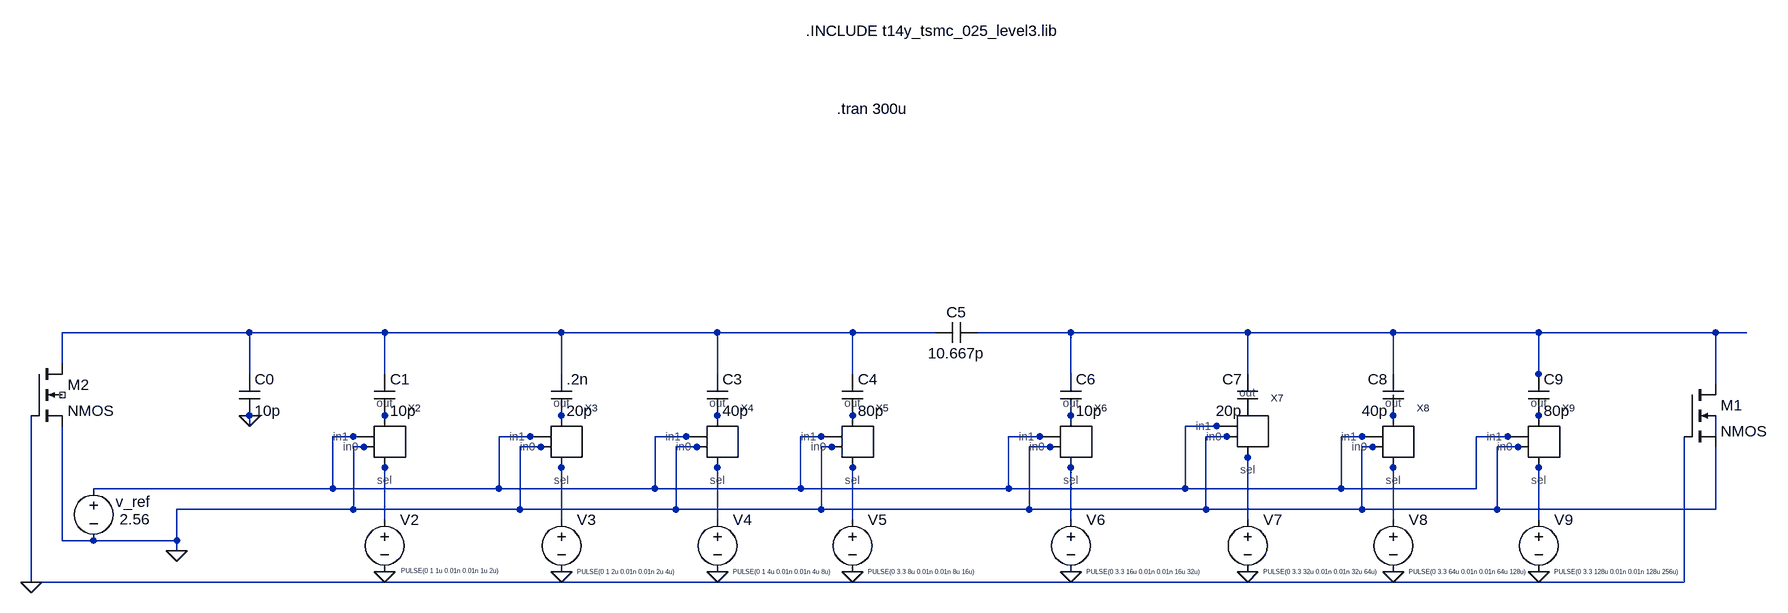
[diagram p0: schematic dac.asc]
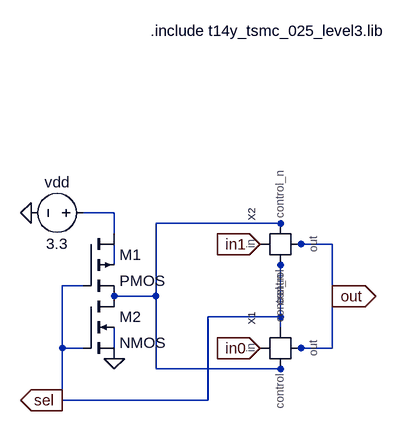
[diagram p1: sub-circuit t_mux.asc]
dac.asc, the LTspice schematic file:
Version 4
SHEET 1 1884 680
WIRE -576 16 -864 16
WIRE -368 16 -576 16
WIRE -96 16 -368 16
WIRE 144 16 -96 16
WIRE 352 16 144 16
WIRE 480 16 352 16
WIRE 688 16 544 16
WIRE 960 16 688 16
WIRE 1184 16 960 16
WIRE 1408 16 1184 16
WIRE 1680 16 1408 16
WIRE 1728 16 1680 16
WIRE -864 64 -864 16
WIRE -576 80 -576 16
WIRE -368 80 -368 16
WIRE -96 80 -96 16
WIRE 144 80 144 16
WIRE 352 80 352 16
WIRE 688 80 688 16
WIRE 960 80 960 16
WIRE 1184 80 1184 16
WIRE 1408 80 1408 16
WIRE 1408 96 1408 80
WIRE 1680 96 1680 16
WIRE -576 144 -576 128
WIRE -368 144 -368 128
WIRE -96 144 -96 128
WIRE 144 144 144 128
WIRE 352 144 352 128
WIRE 688 144 688 128
WIRE 960 144 960 128
WIRE 1184 144 1184 112
WIRE 1408 144 1408 128
WIRE -576 160 -576 144
WIRE -368 160 -368 144
WIRE -96 160 -96 144
WIRE 144 160 144 144
WIRE 352 160 352 144
WIRE 688 160 688 144
WIRE 912 160 864 160
WIRE 944 160 912 160
WIRE 1184 160 1184 144
WIRE 1408 160 1408 144
WIRE -416 176 -448 176
WIRE -384 176 -416 176
WIRE -144 176 -192 176
WIRE -112 176 -144 176
WIRE 96 176 48 176
WIRE 128 176 96 176
WIRE 304 176 272 176
WIRE 336 176 304 176
WIRE 640 176 592 176
WIRE 672 176 640 176
WIRE 928 176 896 176
WIRE 944 176 928 176
WIRE 1136 176 1104 176
WIRE 1168 176 1136 176
WIRE 1360 176 1312 176
WIRE 1376 176 1360 176
WIRE 1680 176 1680 144
WIRE -400 192 -416 192
WIRE -384 192 -400 192
WIRE -128 192 -160 192
WIRE -112 192 -128 192
WIRE 112 192 80 192
WIRE 128 192 112 192
WIRE 320 192 304 192
WIRE 336 192 320 192
WIRE 656 192 624 192
WIRE 672 192 656 192
WIRE 1152 192 1136 192
WIRE 1168 192 1152 192
WIRE 1376 192 1344 192
WIRE 1392 192 1376 192
WIRE 960 208 960 192
WIRE -368 224 -368 208
WIRE -96 224 -96 208
WIRE 144 224 144 208
WIRE 352 224 352 208
WIRE 688 224 688 208
WIRE 1184 224 1184 208
WIRE 1408 224 1408 208
WIRE -448 256 -448 176
WIRE -448 256 -816 256
WIRE -192 256 -192 176
WIRE -192 256 -448 256
WIRE 48 256 48 176
WIRE 48 256 -192 256
WIRE 272 256 272 176
WIRE 272 256 48 256
WIRE 592 256 592 176
WIRE 592 256 272 256
WIRE 864 256 864 160
WIRE 864 256 592 256
WIRE 1104 256 1104 176
WIRE 1104 256 864 256
WIRE 1312 256 1312 176
WIRE 1312 256 1104 256
WIRE -416 288 -416 192
WIRE -416 288 -688 288
WIRE -160 288 -160 192
WIRE -160 288 -416 288
WIRE 80 288 80 192
WIRE 80 288 -160 288
WIRE 304 288 304 192
WIRE 304 288 80 288
WIRE 624 288 624 192
WIRE 624 288 304 288
WIRE 896 288 896 176
WIRE 896 288 624 288
WIRE 1136 288 1136 192
WIRE 1136 288 896 288
WIRE 1344 288 1344 192
WIRE 1344 288 1136 288
WIRE 1680 288 1680 192
WIRE 1680 288 1344 288
WIRE -368 304 -368 224
WIRE -96 304 -96 224
WIRE 144 304 144 224
WIRE 352 304 352 224
WIRE 688 304 688 224
WIRE 960 304 960 208
WIRE 1184 304 1184 224
WIRE 1408 304 1408 224
WIRE -864 336 -864 160
WIRE -816 336 -864 336
WIRE -688 336 -688 288
WIRE -688 336 -816 336
WIRE -688 352 -688 336
WIRE -912 400 -912 144
WIRE 1632 400 1632 176
WIRE 1632 400 -912 400
FLAG -688 352 0
FLAG -912 400 0
FLAG -368 384 0
FLAG -96 384 0
FLAG 144 384 0
FLAG 352 384 0
FLAG 688 384 0
FLAG 960 384 0
FLAG 1184 384 0
FLAG 1408 384 0
FLAG -576 144 0
SYMBOL cap -384 80 R0
SYMATTR InstName C1
SYMATTR Value 10p
SYMBOL cap -112 80 R0
SYMATTR InstName .2n
SYMATTR Value 20p
SYMBOL cap 128 80 R0
SYMATTR InstName C3
SYMATTR Value 40p
SYMBOL cap 336 80 R0
SYMATTR InstName C4
SYMATTR Value 80p
SYMBOL cap 672 80 R0
SYMATTR InstName C6
SYMATTR Value 10p
SYMBOL cap 544 0 R90
WINDOW 0 0 32 VBottom 2
WINDOW 3 32 32 VTop 2
SYMATTR InstName C5
SYMATTR Value 10.667p
SYMBOL cap 976 144 R180
WINDOW 0 24 56 Left 2
WINDOW 3 24 8 Left 2
SYMATTR InstName C7
SYMATTR Value 20p
SYMBOL cap 1200 144 R180
WINDOW 0 24 56 Left 2
WINDOW 3 24 8 Left 2
SYMATTR InstName C8
SYMATTR Value 40p
SYMBOL cap -592 80 R0
SYMATTR InstName C0
SYMATTR Value 10p
SYMBOL t_mux 1408 192 R0
SYMATTR InstName X9
SYMBOL voltage -816 240 R0
WINDOW 123 0 0 Left 0
WINDOW 39 0 0 Left 0
WINDOW 0 34 36 Left 2
WINDOW 3 40 63 Left 2
SYMATTR InstName v_ref
SYMATTR Value 2.56
SYMBOL t_mux -368 192 R0
SYMATTR InstName X2
SYMBOL t_mux -96 192 R0
SYMATTR InstName X3
SYMBOL t_mux 144 192 R0
SYMATTR InstName X4
SYMBOL t_mux 352 192 R0
SYMATTR InstName X5
SYMBOL t_mux 688 192 R0
SYMATTR InstName X6
SYMBOL t_mux 960 176 R0
SYMATTR InstName X7
SYMBOL t_mux 1184 192 R0
SYMATTR InstName X8
SYMBOL nmos4 1632 96 R0
SYMATTR InstName M1
SYMBOL nmos4 -912 64 R0
SYMATTR InstName M2
SYMBOL voltage -368 288 R0
WINDOW 123 0 0 Left 0
WINDOW 39 0 0 Left 0
WINDOW 3 101 101 Bottom 0
SYMATTR Value PULSE(0 1 1u 0.01n 0.01n 1u 2u)
SYMATTR InstName V2
SYMBOL voltage -96 288 R0
WINDOW 123 0 0 Left 0
WINDOW 39 0 0 Left 0
WINDOW 3 24 96 Left 0
SYMATTR Value PULSE(0 1 2u 0.01n 0.01n 2u 4u)
SYMATTR InstName V3
SYMBOL voltage 144 288 R0
WINDOW 123 0 0 Left 0
WINDOW 39 0 0 Left 0
WINDOW 3 24 96 Left 0
SYMATTR Value PULSE(0 1 4u 0.01n 0.01n 4u 8u)
SYMATTR InstName V4
SYMBOL voltage 352 288 R0
WINDOW 123 0 0 Left 0
WINDOW 39 0 0 Left 0
WINDOW 3 24 96 Left 0
SYMATTR Value PULSE(0 3.3 8u 0.01n 0.01n 8u 16u)
SYMATTR InstName V5
SYMBOL voltage 688 288 R0
WINDOW 123 0 0 Left 0
WINDOW 39 0 0 Left 0
WINDOW 3 24 96 Left 0
SYMATTR Value PULSE(0 3.3 16u 0.01n 0.01n 16u 32u)
SYMATTR InstName V6
SYMBOL voltage 960 288 R0
WINDOW 123 0 0 Left 0
WINDOW 39 0 0 Left 0
WINDOW 3 24 96 Left 0
SYMATTR InstName V7
SYMATTR Value PULSE(0 3.3 32u 0.01n 0.01n 32u 64u)
SYMBOL voltage 1184 288 R0
WINDOW 123 0 0 Left 0
WINDOW 39 0 0 Left 0
WINDOW 3 24 96 Left 0
SYMATTR InstName V8
SYMATTR Value PULSE(0 3.3 64u 0.01n 0.01n 64u 128u)
SYMBOL voltage 1408 288 R0
WINDOW 123 0 0 Left 0
WINDOW 39 0 0 Left 0
WINDOW 3 24 96 Left 0
SYMATTR Value PULSE(0 3.3 128u 0.01n 0.01n 128u 256u)
SYMATTR InstName V9
SYMBOL cap 1392 80 R0
SYMATTR InstName C9
SYMATTR Value 80p
TEXT 280 -448 Left 2 !.INCLUDE t14y_tsmc_025_level3.lib
TEXT 328 -328 Left 2 !.tran 300u

t_mux.asc, the sub-circuit schematic file:
Version 4
SHEET 1 880 680
WIRE -32 80 -80 80
WIRE 224 96 32 96
WIRE -32 112 -32 80
WIRE 224 112 224 96
WIRE 208 128 192 128
WIRE 256 128 240 128
WIRE 304 128 256 128
WIRE -32 160 -32 128
WIRE 224 160 224 144
WIRE -80 192 -112 192
WIRE 32 208 32 96
WIRE 32 208 -32 208
WIRE 304 208 304 128
WIRE 224 240 224 160
WIRE 224 240 112 240
WIRE 224 256 224 240
WIRE -112 288 -112 192
WIRE -80 288 -112 288
WIRE -32 288 -32 256
WIRE 208 288 192 288
WIRE 256 288 240 288
WIRE 304 288 304 208
WIRE 304 288 256 288
WIRE 32 320 32 208
WIRE 224 320 224 304
WIRE 224 320 32 320
WIRE -112 368 -112 288
WIRE 112 368 112 240
WIRE 112 368 -112 368
FLAG -160 80 0
FLAG -32 304 0
FLAG 192 128 in1
IOPIN 192 128 In
FLAG 192 288 in0
IOPIN 192 288 In
FLAG 304 208 out
IOPIN 304 208 Out
FLAG -112 368 sel
IOPIN -112 368 Out
SYMBOL pmos4 -80 112 R0
SYMATTR InstName M1
SYMATTR Value2 l=250n w=40u m=200
SYMBOL nmos4 -80 208 R0
SYMATTR InstName M2
SYMATTR Value2 l=250n w=20u m=200
SYMBOL voltage -64 80 R90
WINDOW 0 -32 56 VBottom 2
WINDOW 3 32 56 VTop 2
WINDOW 123 0 0 Left 0
WINDOW 39 0 0 Left 0
SYMATTR InstName vdd
SYMATTR Value 3.3
SYMBOL tg_gate 224 288 R270
SYMATTR InstName X1
SYMBOL tg_gate 224 128 R270
SYMATTR InstName X2
TEXT 24 -200 Left 2 !.include t14y_tsmc_025_level3.lib

The netlist it stands for:
* dac.asc
C1 N001 N003 10p
C§.2n N001 N004 20p
C3 N001 N005 40p
C4 N001 N006 80p
C6 N002 N007 10p
C5 N002 N001 10.667p
C7 N008 N002 20p
C8 N009 N002 40p
C0 N001 0 10p
XX9 N010 N020 N011 0 t_mux
v_ref N011 0 2.56
XX2 N003 N014 N011 0 t_mux
XX3 N004 N015 N011 0 t_mux
XX4 N005 N016 N011 0 t_mux
XX5 N006 N017 N011 0 t_mux
XX6 N007 N018 N011 0 t_mux
XX7 N008 N013 N011 0 t_mux
XX8 N009 N019 N011 0 t_mux
M1 N002 0 0 N012 NMOS
M2 N001 0 0 NC_01 NMOS
V2 N014 0 PULSE(0 1 1u 0.01n 0.01n 1u 2u)
V3 N015 0 PULSE(0 1 2u 0.01n 0.01n 2u 4u)
V4 N016 0 PULSE(0 1 4u 0.01n 0.01n 4u 8u)
V5 N017 0 PULSE(0 3.3 8u 0.01n 0.01n 8u 16u)
V6 N018 0 PULSE(0 3.3 16u 0.01n 0.01n 16u 32u)
V7 N013 0 PULSE(0 3.3 32u 0.01n 0.01n 32u 64u)
V8 N019 0 PULSE(0 3.3 64u 0.01n 0.01n 64u 128u)
V9 N020 0 PULSE(0 3.3 128u 0.01n 0.01n 128u 256u)
C9 N002 N010 80p

* block symbol definitions
.subckt t_mux out sel in1 in0
M1 N001 sel N002 N003 PMOS l=250n w=40u m=200
M2 N002 sel 0 N004 NMOS l=250n w=20u m=200
vdd N001 0 3.3
XX1 in0 out N002 sel tg_gate  ; pins in out control control_n
XX2 in1 out sel N002 tg_gate  ; pins in out control control_n
.include t14y_tsmc_025_level3.lib
.ends t_mux

.model NMOS NMOS
.model PMOS PMOS
.lib standard.mos
.INCLUDE t14y_tsmc_025_level3.lib
.tran 300u
.backanno
.end